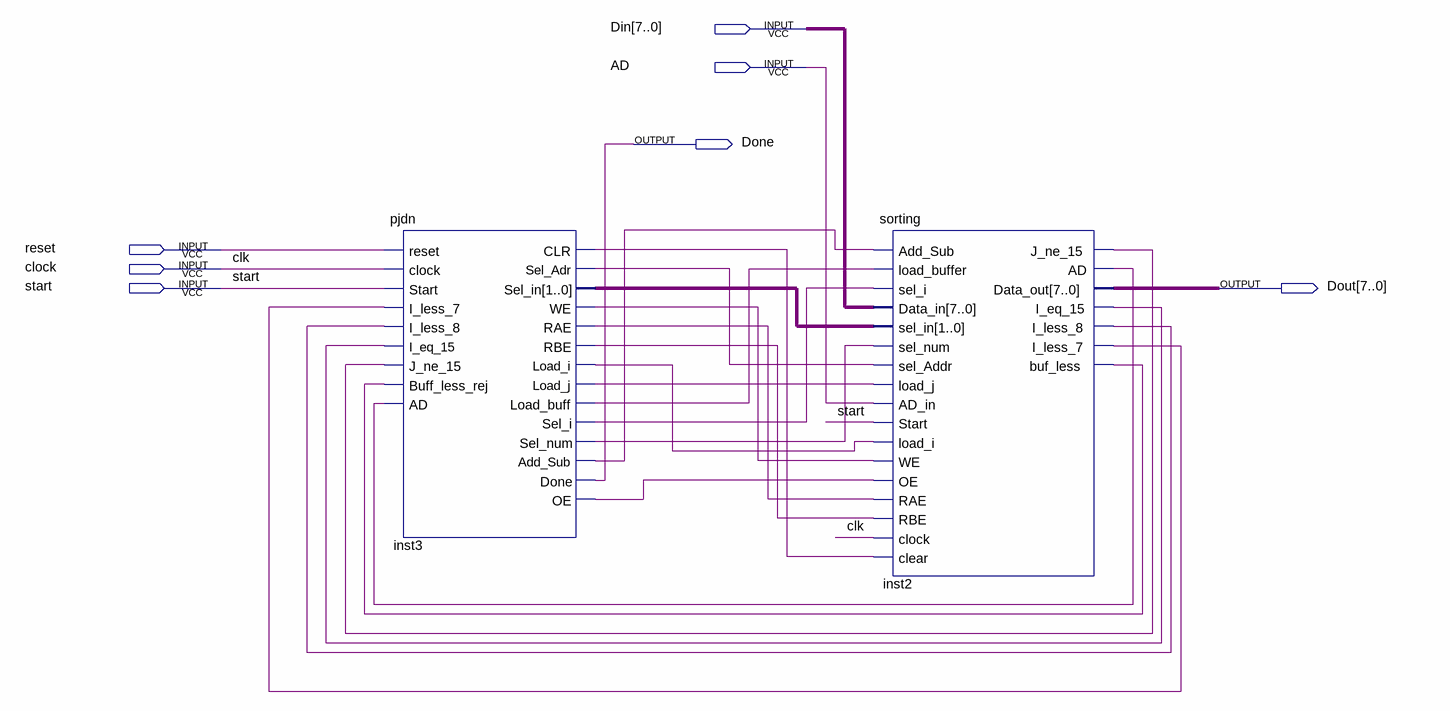
[diagram p0: schematic sheet]
// Quartus schematic Assem.bdf as structural Verilog: 2 symbols, 7 pins
module Assem (
  input  [7:0] Din,
  input  AD,
  input  reset,
  input  clock,
  input  start,
  output Done,
  output [7:0] Dout
);

  wire inst2_ad, inst2_buf_less, inst2_i_eq_15, inst2_i_less_7, inst2_i_less_8, inst2_j_ne_15, inst3_add_sub,
       inst3_clr, inst3_load_buff, inst3_load_i, inst3_load_j, inst3_oe, inst3_rae, inst3_rbe, inst3_sel_adr,
       inst3_sel_i, inst3_sel_num, inst3_we;
  wire [1:0] inst3_sel_in;

  pjdn inst3 (
    .reset(reset), .clock(clock), .Start(start), .I_less_7(inst2_i_less_7), .I_less_8(inst2_i_less_8),
    .I_eq_15(inst2_i_eq_15), .J_ne_15(inst2_j_ne_15), .Buff_less_rej(inst2_buf_less), .AD(inst2_ad),
    .CLR(inst3_clr), .Sel_Adr(inst3_sel_adr), .Sel_in(inst3_sel_in), .WE(inst3_we), .RAE(inst3_rae),
    .RBE(inst3_rbe), .Load_i(inst3_load_i), .Load_j(inst3_load_j), .Load_buff(inst3_load_buff),
    .Sel_i(inst3_sel_i), .Sel_num(inst3_sel_num), .Add_Sub(inst3_add_sub), .Done(Done), .OE(inst3_oe));
  sorting inst2 (
    .Add_Sub(inst3_add_sub), .load_buffer(inst3_load_buff), .sel_i(inst3_sel_i), .Data_in(Din),
    .sel_in(inst3_sel_in), .sel_num(inst3_sel_num), .sel_Addr(inst3_sel_adr), .load_j(inst3_load_j),
    .AD_in(AD), .Start(start), .load_i(inst3_load_i), .WE(inst3_we), .OE(inst3_oe), .RAE(inst3_rae),
    .RBE(inst3_rbe), .clock(clock), .clear(inst3_clr), .J_ne_15(inst2_j_ne_15), .AD(inst2_ad),
    .Data_out(Dout), .I_eq_15(inst2_i_eq_15), .I_less_8(inst2_i_less_8), .I_less_7(inst2_i_less_7),
    .buf_less(inst2_buf_less));

  // Other names for the same wires on the sheet: clk = clock
endmodule
